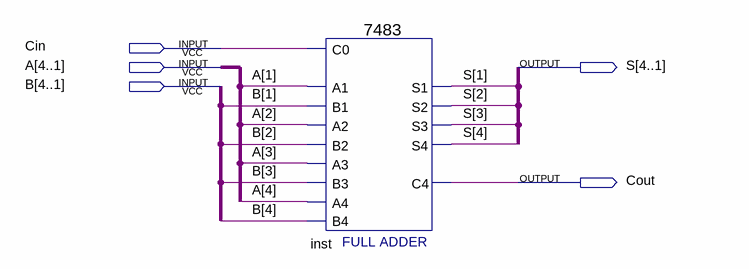
[diagram p0: schematic sheet]
// Quartus schematic mf7483_sch.bdf as structural Verilog: 1 symbols, 5 pins
module mf7483_sch (
  input  Cin,
  input  [4:1] A,
  input  [4:1] B,
  output [4:1] S,
  output Cout
);

  \7483  inst (
    .B4(B[4]), .C0(Cin), .A1(A[1]), .A2(A[2]), .B1(B[1]), .B2(B[2]), .A3(A[3]), .B3(B[3]), .A4(A[4]),
    .S3(S[3]), .S4(S[4]), .S2(S[2]), .C4(Cout), .S1(S[1]));
endmodule
